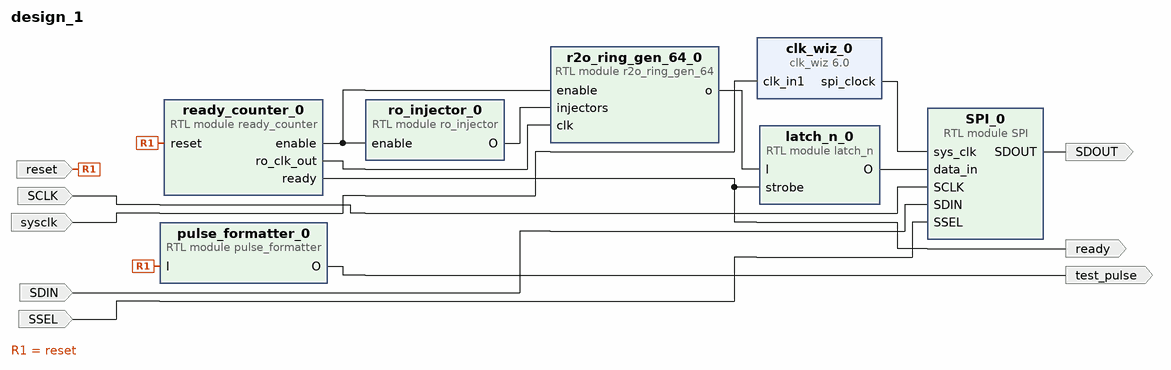
[diagram p0: block diagram of the top level]
# Vivado block design design_1, xc7a15tcpg236-1, Vivado 2021.1
create_bd_design design_1

create_bd_port -dir I -type clk sysclk
set_property -dict {CONFIG.ASSOCIATED_RESET pio3} [get_bd_ports sysclk]
create_bd_port -dir I SCLK
create_bd_port -dir I SDIN
create_bd_port -dir O SDOUT
create_bd_port -dir I SSEL
create_bd_port -dir I -type rst reset
create_bd_port -dir O ready
create_bd_port -dir O test_pulse

create_bd_cell -type module -reference latch_n latch_n_0
set_property -dict {CONFIG.N 64} [get_bd_cells latch_n_0]
create_bd_cell -type module -reference SPI SPI_0
set_property -dict {CONFIG.N 64} [get_bd_cells SPI_0]
create_bd_cell -type ip -vlnv xilinx.com:ip:clk_wiz:6.0 clk_wiz_0
set_property -dict [list \
  CONFIG.CLKIN1_JITTER_PS 100.0 \
  CONFIG.CLKOUT1_JITTER 130.958 \
  CONFIG.CLKOUT1_PHASE_ERROR 98.575 \
  CONFIG.CLKOUT1_REQUESTED_OUT_FREQ 100 \
  CONFIG.CLK_IN1_BOARD_INTERFACE sys_clock \
  CONFIG.CLK_OUT1_PORT spi_clock \
  CONFIG.MMCM_CLKFBOUT_MULT_F 10.000 \
  CONFIG.MMCM_CLKIN1_PERIOD 10.000 \
  CONFIG.MMCM_CLKIN2_PERIOD 10.000 \
  CONFIG.MMCM_CLKOUT0_DIVIDE_F 10.000 \
  CONFIG.USE_LOCKED false \
  CONFIG.USE_RESET false \
] [get_bd_cells clk_wiz_0]
create_bd_cell -type module -reference pulse_formatter pulse_formatter_0
set_property -dict {CONFIG.INV_COUNT 31} [get_bd_cells pulse_formatter_0]
create_bd_cell -type module -reference ready_counter ready_counter_0
set_property -dict {CONFIG.N 8} [get_bd_cells ready_counter_0]
create_bd_cell -type module -reference ro_injector ro_injector_0
set_property -dict {CONFIG.N 64} [get_bd_cells ro_injector_0]
create_bd_cell -type module -reference r2o_ring_gen_64 r2o_ring_gen_64_0
set_property -dict {CONFIG.dense 1} [get_bd_cells r2o_ring_gen_64_0]

# ---- connections ----

connect_bd_net -net SCLK_0_1 [get_bd_ports SCLK] [get_bd_pins SPI_0/SCLK]
connect_bd_net -net SDIN_0_1 [get_bd_ports SDIN] [get_bd_pins SPI_0/SDIN]
connect_bd_net [get_bd_pins SPI_0/SDOUT] [get_bd_ports SDOUT]
connect_bd_net -net SSEL_0_1 [get_bd_ports SSEL] [get_bd_pins SPI_0/SSEL]
connect_bd_net -net clk_in1_0_1 [get_bd_ports sysclk] [get_bd_pins clk_wiz_0/clk_in1]
connect_bd_net [get_bd_pins clk_wiz_0/spi_clock] [get_bd_pins SPI_0/sys_clk]
connect_bd_net -net enable_0_1 [get_bd_pins ready_counter_0/enable] [get_bd_pins ro_injector_0/enable] [get_bd_pins r2o_ring_gen_64_0/enable]
connect_bd_net [get_bd_pins latch_n_0/O] [get_bd_pins SPI_0/data_in]
connect_bd_net [get_bd_pins pulse_formatter_0/O] [get_bd_ports test_pulse]
connect_bd_net [get_bd_pins r2o_ring_gen_64_0/o] [get_bd_pins latch_n_0/I]
connect_bd_net [get_bd_pins ready_counter_0/ready] [get_bd_ports ready] [get_bd_pins latch_n_0/strobe]
connect_bd_net [get_bd_pins ready_counter_0/ro_clk_out] [get_bd_pins r2o_ring_gen_64_0/clk]
connect_bd_net -net reset_0_1 [get_bd_ports reset] [get_bd_pins pulse_formatter_0/I] [get_bd_pins ready_counter_0/reset]
connect_bd_net [get_bd_pins ro_injector_0/O] [get_bd_pins r2o_ring_gen_64_0/injectors]

validate_bd_design
save_bd_design
